# EAGLE design firefly (EAGLE 5.00)
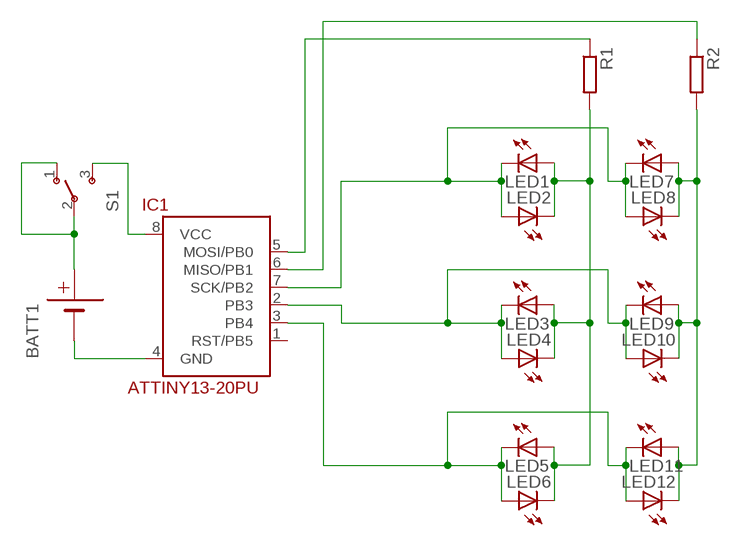
[diagram p0: schematic, sheet 1]

## Parts
BATT1  COIN_CELL_HOLDER  [COIN_CELL_HOLDER_20MM]
IC1  ATTINY13-20PU  [DIL08]
LED1  LED3MM  [LED3MM]
LED2  LED3MM  [LED3MM]
LED3  LED3MM  [LED3MM]
LED4  LED3MM  [LED3MM]
LED5  LED3MM  [LED3MM]
LED6  LED3MM  [LED3MM]
LED7  LED3MM  [LED3MM]
LED8  LED3MM  [LED3MM]
LED9  LED3MM  [LED3MM]
LED10  LED3MM  [LED3MM]
LED11  LED3MM  [LED3MM]
LED12  LED3MM  [LED3MM]
R1  R-EU_0207/10  [0207/10]
R2  R-EU_0207/10  [0207/10]
S1  SWITCH-SPSTPTH  [SWITCH-SPST]

## Nets
N$1: BATT1.+ S1.1(O) S1.2(P)
N$2: BATT1.- IC1.4(GND)
N$3: IC1.5(MOSI/PB0) R1.1
N$4: IC1.6(MISO/PB1) R2.1
N$5: LED1.A LED2.K(C) LED3.A LED4.K(C) LED5.A LED6.K(C) R1.2
N$6: LED7.A LED8.K(C) LED9.A LED10.K(C) LED11.A LED12.K(C) R2.2
N$7: IC1.8(VCC) S1.3(S)
N$10: IC1.7(SCK/PB2) LED1.K(C) LED2.A LED7.K(C) LED8.A
N$11: IC1.2(PB3) LED3.K(C) LED4.A LED9.K(C) LED10.A
N$12: IC1.3(PB4) LED5.K(C) LED6.A LED11.K(C) LED12.A
Unconnected: IC1.1(RST/PB5)

## Library data of the parts
BATT1 = AdamGreig:COIN_CELL_HOLDER
IC1 = attiny13:ATTINY13-20*
LED1-LED12 = led:LED: LED OSRAM: - CHIPLED LG R971, LG N971, LY N971, LG Q971, LY Q971, LO R971, LY R971 LH N974, LH R974 LS Q976, LO Q976, LY Q976 LO Q996 - Hyper CHIPLED LW Q18S LB Q993, LB Q99A, LB R99A - SideLED LS A670, LO A670, LY A670, LG A670, LP A670 LB A673, LV A673, LT A673, LW A673 LH A674 LY A675 LS A676, LA A676, LO A676, LY A676, LW A676 LS A679, LY A679, LG A679 - Hyper Micro SIDELED® LS Y876, LA Y876, LO Y876, LY Y876 LT Y87S - SmartLED LW L88C, LW L88S LB L89C, LB L89S, LG L890 LS L89K, LO L89K, LY L89K LS L896, LA L896, LO L896, LY L896 - TOPLED LS T670, LO T670, LY T670, LG T670, LP T670 LSG T670, LSP T670, LSY T670, LOP T670, LYG T670 LG T671, LOG T671, LSG T671 LB T673, LV T673, LT T673, LW T673 LH T674 LS T676, LA T676, LO T676, LY T676, LB T676, LH T676, LSB T676, LW T676 LB T67C, LV T67C, LT T67C, LS T67K, LO T67K, LY T67K, LW E67C LS E67B, LA E67B, LO E67B, LY E67B, LB E67C, LV E67C, LT E67C LW T67C LS T679, LY T679, LG T679 LS T770, LO T770, LY T770, LG T770, LP T770 LB T773, LV T773, LT T773, LW T773 LH T774 LS E675, LA E675, LY E675, LS T675 LS T776, LA T776, LO T776, LY T776, LB T776 LHGB T686 LT T68C, LB T68C - Hyper Mini TOPLED® LB M676 - Mini TOPLED Santana® LG M470 LS M47K, LO M47K, LY M47K Source: http://www.osram.convergy.de - LUMILED® LXK2-PW12-R00, LXK2-PW12-S00, LXK2-PW14-U00, LXK2-PW14-V00 LXK2-PM12-R00, LXK2-PM12-S00, LXK2-PM14-U00 LXK2-PE12-Q00, LXK2-PE12-R00, LXK2-PE12-S00, LXK2-PE14-T00, LXK2-PE14-U00 LXK2-PB12-K00, LXK2-PB12-L00, LXK2-PB12-M00, LXK2-PB14-N00, LXK2-PB14-P00, LXK2-PB14-Q00 LXK2-PR12-L00, LXK2-PR12-M00, LXK2-PR14-Q00, LXK2-PR14-R00 LXK2-PD12-Q00, LXK2-PD12-R00, LXK2-PD12-S00 LXK2-PH12-R00, LXK2-PH12-S00 LXK2-PL12-P00, LXK2-PL12-Q00, LXK2-PL12-R00 Source: www.luxeon.com
R1 R2 = rcl:R-EU_: RESISTOR, European symbol
S1 = SparkFun:SWITCH-SPST: SPST Switch Simple slide switch. Spark Fun Electronics SKU : COM-00102

## Board
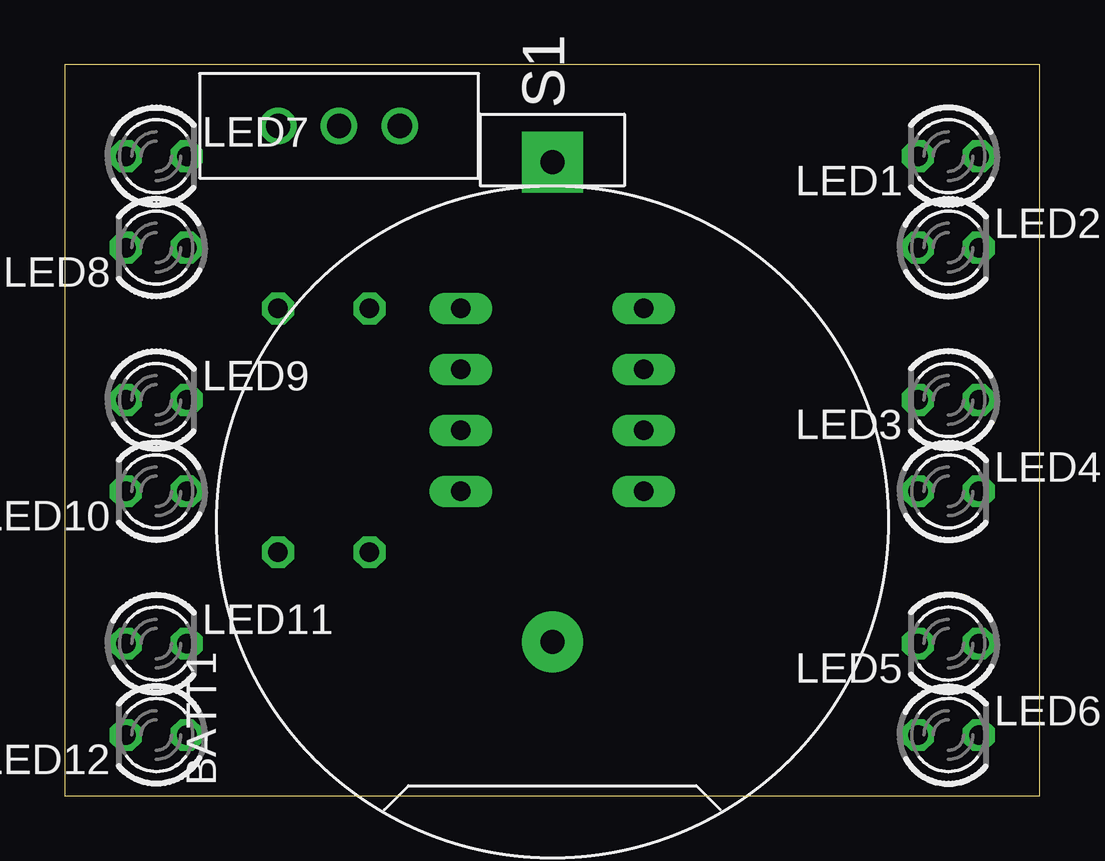
[diagram p1: board, top side]
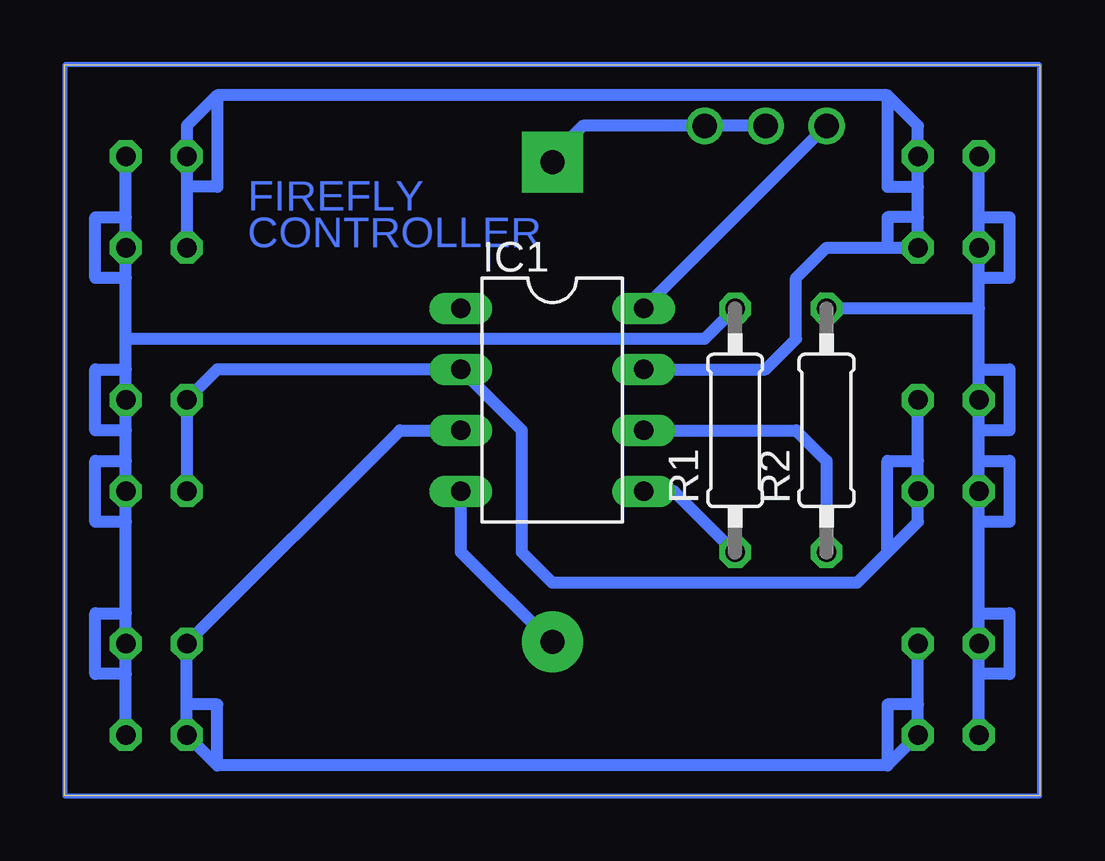
[diagram p2: board, bottom side, seen from below]

Size 40.64 x 30.48 mm. Coordinates in mm from the lower left corner, seen from the top.
Outline: 0,0 40.64,0 40.64,30.48 0,30.48 0,0
Copper layers (1*16): Top 0.035mm / dielectric 1.5mm / Bottom 0.035mm
Design rules "default *": minimum track width 10mil, minimum drill 24mil, track to track 8mil, track to pad 8mil, pad to pad 8mil, via to via 8mil, smd to smd 8mil, copper to edge 40mil, drill to drill 8mil, minimum pad ring 10mil, minimum via ring 8mil, stop-mask expansion 4mil, vias tented up to drill 0mil, thermal gap 10mil

### Footprints (pad centres in the part's own frame; a part is rotated, then mirrored left to right if it is on the bottom)
COIN_CELL_HOLDER_20MM = drill 1 pad 2.54 square: + 15,0 | drill 1 pad 2.54 round: - -5,0
DIL08 = drill 0.813 long: 1 -3.81,-3.81; 2 -1.27,-3.81; 3 1.27,-3.81; 4 3.81,-3.81; 5 3.81,3.81; 6 1.27,3.81; 7 -1.27,3.81; 8 -3.81,3.81
LED3MM = drill 0.813 octagon: A -1.27,0; K 1.27,0
0207/10 = drill 0.813 octagon: 1 -5.08,0; 2 5.08,0
SWITCH-SPST = drill 1.016 round: 1 0,2.54; 2 0,0; 3 0,-2.54

### Placement (x,y rotation side)
BATT1  20.32,11.43 90 top
IC1  20.32,16.51 270 bottom
LED1  36.83,26.67 180 top
LED2  36.83,22.86 0 top
LED3  36.83,16.51 180 top
LED4  36.83,12.7 0 top
LED5  36.83,6.35 180 top
LED6  36.83,2.54 0 top
LED7  3.81,26.67 0 top
LED8  3.81,22.86 180 top
LED9  3.81,16.51 0 top
LED10  3.81,12.7 180 top
LED11  3.81,6.35 0 top
LED12  3.81,2.54 180 top
R1  12.7,15.24 90 bottom
R2  8.89,15.24 90 bottom
S1  11.43,27.94 270 top

### Tracks (layer width: path | path; a pad name or v marks a point on that pad's centre or on a via)
N$1
  Bottom 0.508: BATT1.+ 20.32,26.67 19.05,27.94 S1.1 S1.2
N$2
  Bottom 0.508: BATT1.- 20.32,6.35 24.13,10.16 IC1.4
N$3
  Bottom 0.508: IC1.5 15.24,12.7 R1.1
N$4
  Bottom 0.508: IC1.6 10.16,15.24 8.89,13.97 R2.1
N$5
  Bottom 0.508: 38.1,24.13 LED2.K 38.1,21.59 | 38.1,24.13 LED1.A | 38.1,13.97 LED4.K 38.1,11.43 | 38.1,13.97 38.1,15.24 | 38.1,15.24 LED3.A 38.1,17.78 | 38.1,7.62 LED5.A 38.1,5.08 | 38.1,7.62 38.1,11.43 | LED6.K 38.1,5.08 | 38.1,17.78 38.1,19.05 | 38.1,19.05 38.1,21.59 | R1.2 13.97,19.05 38.1,19.05 | 38.1,5.08 39.37,5.08 39.37,7.62 38.1,7.62 | 38.1,11.43 39.37,11.43 39.37,13.97 38.1,13.97 | 38.1,15.24 39.37,15.24 39.37,17.78 38.1,17.78 | 38.1,21.59 39.37,21.59 39.37,24.13 38.1,24.13
N$6
  Bottom 0.508: LED12.K 2.54,5.08 | 2.54,5.08 LED11.A 2.54,7.62 | 2.54,7.62 2.54,11.43 | 2.54,11.43 LED10.K 2.54,13.97 | 2.54,13.97 2.54,15.24 | 2.54,15.24 LED9.A 2.54,17.78 | 2.54,24.13 LED8.K 2.54,21.59 | 2.54,24.13 LED7.A | 2.54,17.78 2.54,20.32 | 2.54,20.32 2.54,21.59 | 2.54,20.32 R2.2 | 2.54,24.13 1.27,24.13 1.27,21.59 2.54,21.59 | 2.54,17.78 1.27,17.78 1.27,15.24 2.54,15.24 | 2.54,13.97 1.27,13.97 1.27,11.43 2.54,11.43 | 2.54,7.62 1.27,7.62 1.27,5.08 2.54,5.08
N$7
  Bottom 0.508: IC1.8 S1.3
N$8
  Bottom 0.203: 0,30.48 40.64,30.48 40.64,0 0,0 0,30.48
N$10
  Bottom 0.508: 35.56,25.4 LED1.K 35.56,27.94 34.29,29.21 | 35.56,25.4 LED2.A | 5.08,25.4 LED7.K | 5.08,24.13 LED8.A 6.35,22.86 | 5.08,24.13 5.08,25.4 | 5.08,25.4 5.08,27.94 6.35,29.21 | 6.35,29.21 34.29,29.21 | IC1.7 11.43,17.78 10.16,19.05 10.16,21.59 8.89,22.86 6.35,22.86 | 34.29,29.21 34.29,25.4 35.56,25.4 | 6.35,29.21 6.35,25.4 5.08,25.4 | 5.08,24.13 6.35,24.13 6.35,22.86
N$11
  Bottom 0.508: LED4.A LED3.K 34.29,17.78 IC1.2 21.59,15.24 21.59,10.16 20.32,8.89 7.62,8.89 6.35,10.16 | 5.08,13.97 LED10.A 5.08,11.43 6.35,10.16 | 5.08,13.97 LED9.K | 6.35,10.16 6.35,13.97 5.08,13.97
N$12
  Bottom 0.508: 35.56,3.81 LED6.A 34.29,1.27 | 35.56,3.81 LED5.K 26.67,15.24 IC1.3 | 5.08,3.81 LED12.A 6.35,1.27 | 5.08,3.81 LED11.K | 6.35,1.27 34.29,1.27 | 5.08,3.81 6.35,3.81 6.35,1.27 | 34.29,1.27 34.29,3.81 35.56,3.81

### Text on the board
Bottom: FIREFLY | CONTROLLER
_tsilk: FIREFLY | CONTROLLER | ADAM GREIG | Oct 08